# Altium schematic sheet Power.SchDoc
size A4; SheetNumber: 2; SheetTotal: 13
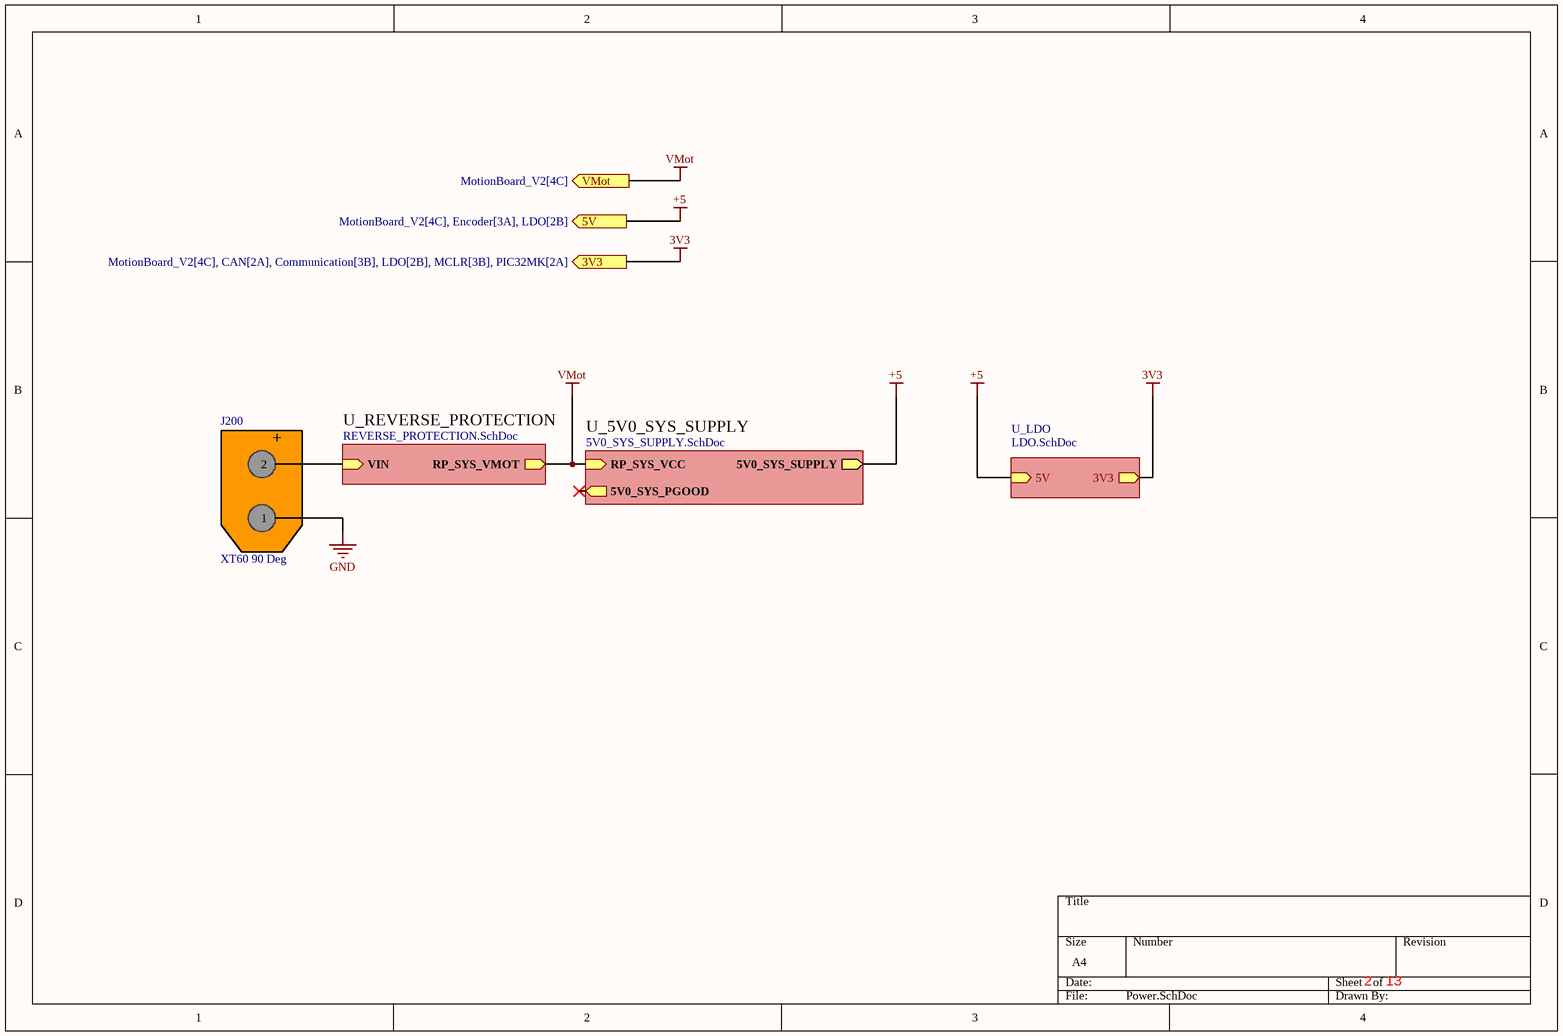
[diagram p0: Power.SchDoc]

## Parts
J200  XT60 90 Deg  [XT60PW-M]

## Sub-sheets
U_5V0_SYS_SUPPLY = 5V0_SYS_SUPPLY.SchDoc: 5V0_SYS_SUPPLY (out), 5V0_SYS_PGOOD (out), RP_SYS_VCC (in)
U_LDO = LDO.SchDoc: 5V (in), 3V3 (out)
U_REVERSE_PROTECTION = REVERSE_PROTECTION.SchDoc: VIN (in), RP_SYS_VMOT (out)

## Ports
3V3 (out, see MotionBoard_V2[4C], CAN[2A], Communication[3B], LDO[2B], MCLR[3B], PIC32MK[2A]), 5V (out, see MotionBoard_V2[4C], Encoder[3A], LDO[2B]), VMot (out, see MotionBoard_V2[4C])

## Nets
3V3: port 3V3, sheet U_LDO/3V3
+5: port 5V, sheet U_5V0_SYS_SUPPLY/5V0_SYS_SUPPLY, sheet U_LDO/5V
GND: J200.1
VMot: port VMot, sheet U_REVERSE_PROTECTION/RP_SYS_VMOT, sheet U_5V0_SYS_SUPPLY/RP_SYS_VCC
NetJ200_2: J200.2 ; sheet U_REVERSE_PROTECTION/VIN

## Notes on the sheet
- 2
- 13
- (in symbol XT60PW-M) +

## Library data of the parts
J200 = XT60PW-M